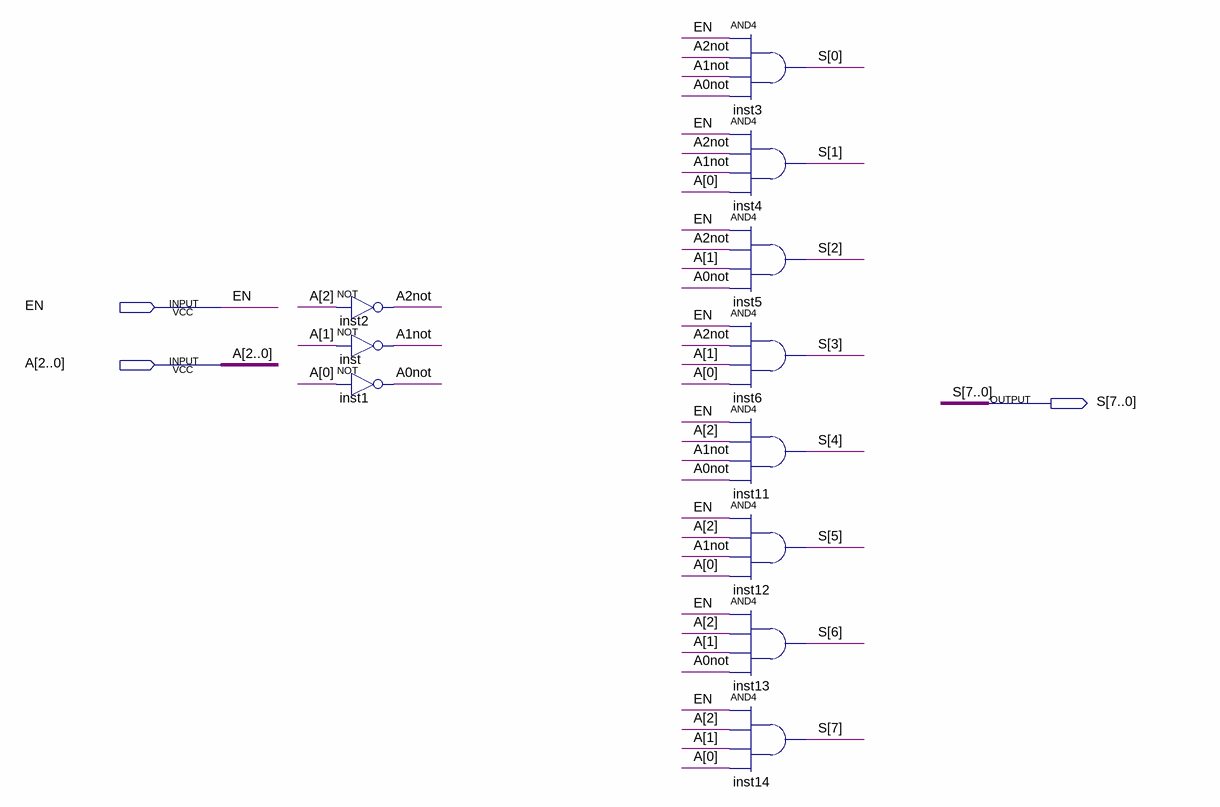
[diagram p0: schematic sheet]
// Quartus schematic decoder_3_to_8.bdf as structural Verilog: 11 symbols, 3 pins
module decoder_3_to_8 (
  input  EN,
  input  [2:0] A,
  output [7:0] S
);

  wire A0not, A1not, A2not;

  not inst2 (A2not, A[2]);
  not inst (A1not, A[1]);
  not inst1 (A0not, A[0]);
  and inst3 (S[0], EN, A2not, A1not, A0not);
  and inst4 (S[1], EN, A2not, A1not, A[0]);
  and inst5 (S[2], EN, A2not, A[1], A0not);
  and inst6 (S[3], EN, A2not, A[1], A[0]);
  and inst11 (S[4], EN, A[2], A1not, A0not);
  and inst12 (S[5], EN, A[2], A1not, A[0]);
  and inst13 (S[6], EN, A[2], A[1], A0not);
  and inst14 (S[7], EN, A[2], A[1], A[0]);
endmodule
